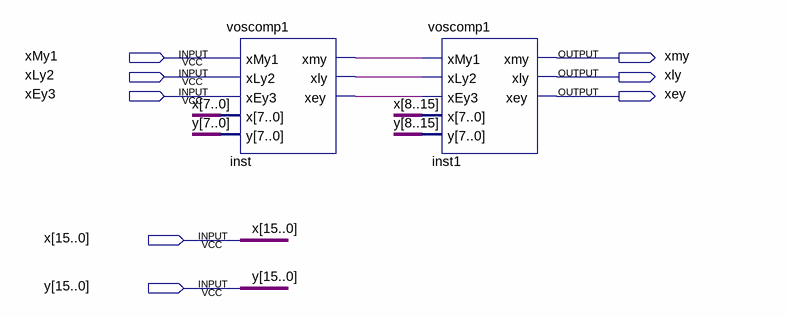
[diagram p0: schematic sheet]
// Quartus schematic hsestcomp1.bdf as structural Verilog: 2 symbols, 8 pins
module hsestcomp1 (
  input  xMy1,
  input  xLy2,
  input  xEy3,
  input  [15:0] x,
  input  [15:0] y,
  output xmy,
  output xly,
  output xey
);

  wire inst_xey, inst_xly, inst_xmy;

  voscomp1 inst (
    .xMy1(xMy1), .xLy2(xLy2), .xEy3(xEy3), .x(x[7:0]), .y(y[7:0]), .xmy(inst_xmy), .xly(inst_xly),
    .xey(inst_xey));
  voscomp1 inst1 (
    .xMy1(inst_xmy), .xLy2(inst_xly), .xEy3(inst_xey),
    .x({x[8], x[9], x[10], x[11], x[12], x[13], x[14], x[15]}),
    .y({y[8], y[9], y[10], y[11], y[12], y[13], y[14], y[15]}), .xmy(xmy), .xly(xly), .xey(xey));
endmodule
